# Altium schematic sheet smartGarden_COM2_Rev01.SchDoc
size A
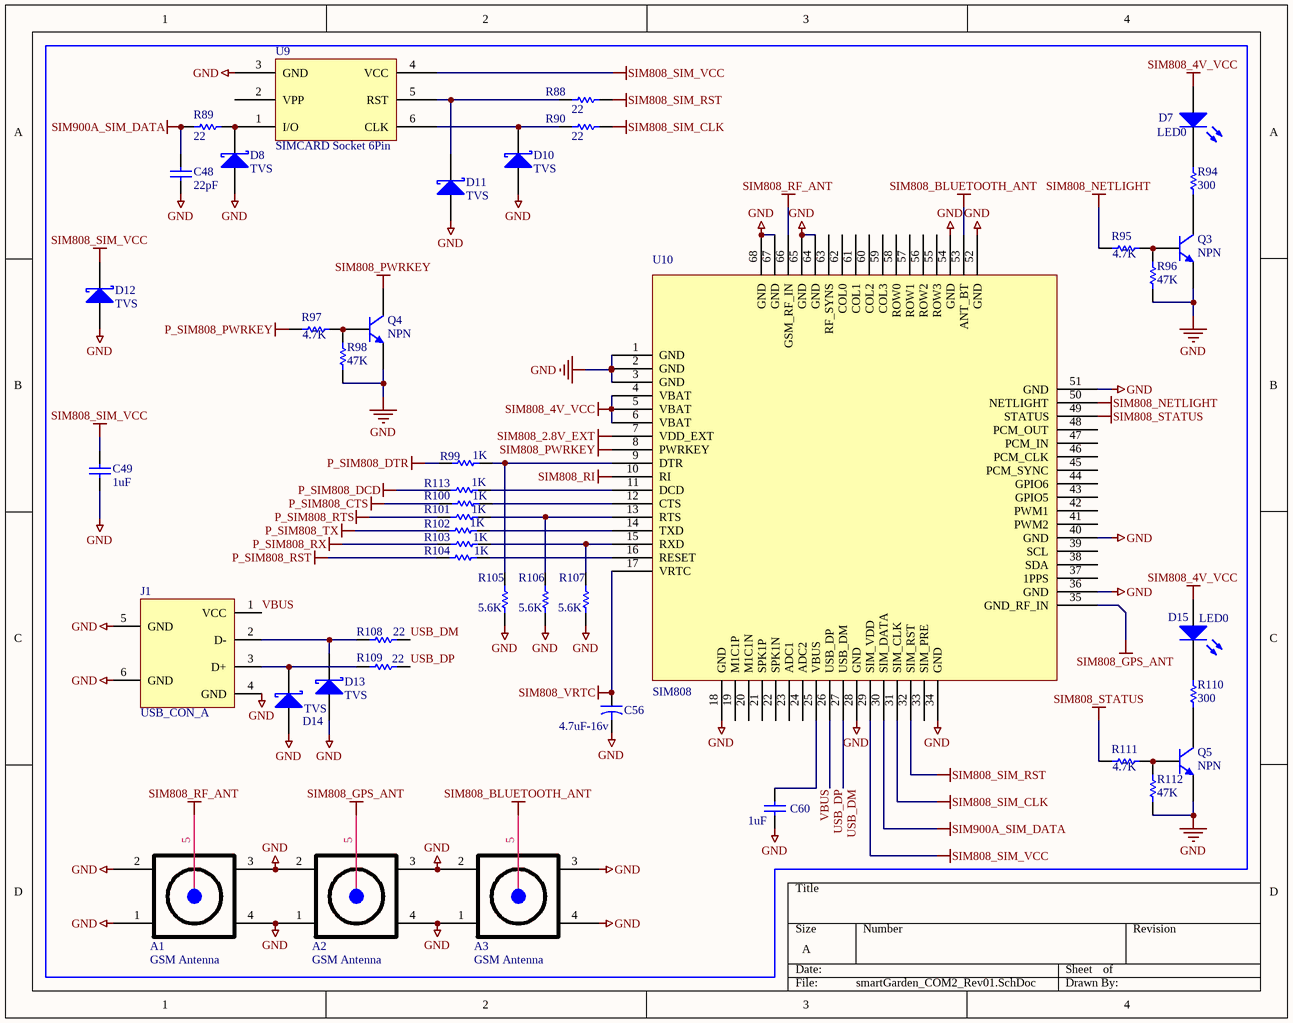
[diagram p0: smartGarden_COM2_Rev01.SchDoc]

## Parts
A1  GSM Antenna  [SMA Right Female]
A2  GSM Antenna  [SMA Right Female]
A3  GSM Antenna  [SMA Right Female]
C48  22pF  [0805_smd]
C49  1uF  [0805_smd]
C56  value 4.7uF-16v  [CAPR5-4X5]  (hidden comment: Cap2)
C60  1uF  [0805_smd]
D7  LED0  [0805_LED]
D8  TVS  [7227_SMD]
D10  TVS  [7227_SMD]
D11  TVS  [7227_SMD]
D12  TVS  [7227_SMD]
D13  TVS  [7227_SMD]
D14  TVS  [7227_SMD]
D15  LED0  [0805_LED]
J1  USB_CON_A  [USB_CON_A]
Q3  NPN  [TO-226-AA]
Q4  NPN  [TO-226-AA]
Q5  NPN  [TO-226-AA]
R88  22  [0805_SMD]
R89  22  [1206_SMD]
R90  22  [0805_SMD]
R94  300  [0805_SMD]
R95  4.7K  [0805_SMD]
R96  47K  [0805_SMD]
R97  4.7K  [0805_SMD]
R98  47K  [0805_SMD]
R99  1K  [1206_SMD]
R100  1K  [1206_SMD]
R101  1K  [1206_SMD]
R102  1K  [1206_SMD]
R103  1K  [1206_SMD]
R104  1K  [1206_SMD]
R105  5.6K  [1206_SMD]
R106  5.6K  [1206_SMD]
R107  5.6K  [1206_SMD]
R108  22  [1206_SMD]
R109  22  [1206_SMD]
R110  300  [0805_SMD]
R111  4.7K  [0805_SMD]
R112  47K  [0805_SMD]
R113  1K  [1206_SMD]
U9  SIMCARD Socket 6Pin  [6PIN _SIMCARD]
U10  SIM808

## Nets
GND: A1.1 A1.2 A1.3 A1.4 A2.1 A2.2 A2.3 A2.4 A3.1 A3.2 A3.3 A3.4 C48.1 C49.1 C56.2 C60.1 D8.A D10.A D11.A D12.A D13.A D14.A J1.4(GND) J1.5(GND) J1.6(GND) Q3.3(E) Q4.3(E) Q5.3(E) R96.1 R98.1 R105.2 R106.2 R107.2 R112.1 U9.3(GND) U10.1(GND) U10.2(GND) U10.3(GND) U10.18(GND) U10.28(GND) U10.34(GND) U10.36(GND) U10.40(GND) U10.51(GND) U10.52(GND) U10.54(GND) U10.64(GND) U10.65(GND) U10.67(GND) U10.68(GND)
P_SIM808_CTS: R100.2
P_SIM808_DCD: R113.2
P_SIM808_DTR: R99.2
P_SIM808_PWRKEY: R97.1
P_SIM808_RST: R104.2
P_SIM808_RTS: R101.2
P_SIM808_RX: R103.2
P_SIM808_TX: R102.2
SIM808_2.8V_EXT: U10.7(VDD_EXT)
SIM808_4V_VCC: D7.1(A) D15.1(A) U10.4(VBAT) U10.5(VBAT) U10.6(VBAT)
SIM808_BLUETOOTH_ANT: A3.5 U10.53(ANT_BT)
SIM808_GPS_ANT: A2.5 U10.35(GND_RF_IN)
SIM808_NETLIGHT: R95.1 U10.50(NETLIGHT)
SIM808_PWRKEY: Q4.1(C) U10.8(PWRKEY)
SIM808_RF_ANT: A1.5 U10.66(GSM_RF_IN)
SIM808_RI: U10.10(RI)
SIM808_SIM_CLK: R90.2 U10.31(SIM_CLK)
SIM808_SIM_RST: R88.2 U10.32(SIM_RST)
SIM808_SIM_VCC: C49.2 D12.K U9.4(VCC) U10.29(SIM_VDD)
SIM808_STATUS: R111.1 U10.49(STATUS)
SIM808_VRTC: C56.1 U10.17(VRTC)
SIM900A_SIM_DATA: C48.2 R89.2 U10.30(SIM_DATA)
USB_DM: R108.2 U10.27(USB_DM)
USB_DP: R109.2 U10.26(USB_DP)
VBUS: C60.2 J1.1(VCC) U10.25(VBUS)
NetD7_2: D7.2(K) R94.2
NetD8_K: D8.K R89.1 U9.1(I/O)
NetD10_K: D10.K R90.1 U9.6(CLK)
NetD11_K: D11.K R88.1 U9.5(RST)
NetD13_K: D13.K J1.2(D-) R108.1
NetD14_K: D14.K J1.3(D+) R109.1
NetD15_2: D15.2(K) R110.2
NetQ3_1: Q3.1(C) R94.1
NetQ3_2: Q3.2(B) R95.2 R96.2
NetQ4_2: Q4.2(B) R97.2 R98.2
NetQ5_1: Q5.1(C) R110.1
NetQ5_2: Q5.2(B) R111.2 R112.2
NetR99_1: R99.1 R105.1 U10.9(DTR)
NetR100_1: R100.1 U10.12(CTS)
NetR101_1: R101.1 R106.1 U10.13(RTS)
NetR102_1: R102.1 U10.14(TXD)
NetR103_1: R103.1 R107.1 U10.15(RXD)
NetR104_1: R104.1 U10.16(RESET)
NetR113_1: R113.1 U10.11(DCD)

Not connected (* = marked no-connect by the designer): U9 2(VPP); U10 19(M1C1P) 20(M1C1N) 21(SPK1P) 22(SPK1N) 23(ADC1) 24(ADC2) 33(SIM_PRE) 37(1PPS) 38(SDA) 39(SCL) 41(PWM2) 42(PWM1) 43(GPIO5) 44(GPIO6) 45(PCM_SYNC) 46(PCM_CLK) 47(PCM_IN) 48(PCM_OUT) 55(ROW3) 56(ROW2) 57(ROW1) 58(ROW0) 59(COL3) 60(COL2) 61(COL1) 62(COL0) 63(RF_SYNS)

## Library data of the parts
A1-A3 = SMA KWE-F
C48 C49 C60 = Cap: Capacitor; Value: 100u; Published: 8-Jun-2000; LatestRevisionDate: 17-Jul-2002; LatestRevisionNote: Re-released for DXP Platform.; PackageReference: RAD-0.3; Publisher: Altium Limited
C56 = Cap2: Capacitor; Published: 23-Sep-2002; PackageReference: CAPR5-4X5; Publisher: Altium Limited; PackageDescription: Capacitor; 2 Leads
D7 D15 = LED0: Typical INFRARED GaAs LED; Published: 8-Jun-2000; LatestRevisionDate: 08-Jul-2005; LatestRevisionNote: Mech Layer 1 removed.; PackageReference: LED-0; Publisher: Altium Limited; PackageDescription: LED; 2 Leads
D8 D10-D14 = D Schottky: Schottky Diode; Published: 8-Jun-2000; LatestRevisionDate: 17-Jul-2002; LatestRevisionNote: Re-released for DXP Platform.; PackageReference: SMB; Publisher: Altium Limited; Code_JEDEC: DO-214-AA
Q3-Q5 = NPN: NPN Bipolar Transistor; Published: 8-Jun-2000; LatestRevisionDate: 17-Jul-2002; LatestRevisionNote: Re-released for DXP Platform.; PackageReference: TO-226-AA; Publisher: Altium Limited; PackageDescription: TO, Flat Index; 3 In-Line, Axial Leads; Body Dia. 4.8mm; Leads 0.55 x 0.51 mm (max); Code_JEDEC: TO-226-AA
R88-R90 R108 R109 = Res1: Resistor; Published: 8-Jun-2000; LatestRevisionDate: 17-Jul-2002; LatestRevisionNote: Re-released for DXP Platform.; PackageReference: AXIAL-0.3; Publisher: Altium Limited; Value: 22
R94-R107 R110-R113 = Res1: Resistor; Value: 22; Published: 8-Jun-2000; LatestRevisionDate: 17-Jul-2002; LatestRevisionNote: Re-released for DXP Platform.; PackageReference: AXIAL-0.3; Publisher: Altium Limited
U9 = SIM_SOCKET_6PIN
U10 = SIM 808 GSM/GPRS/GPS